# Altium project PCB_LED4PIN.PrjPcb
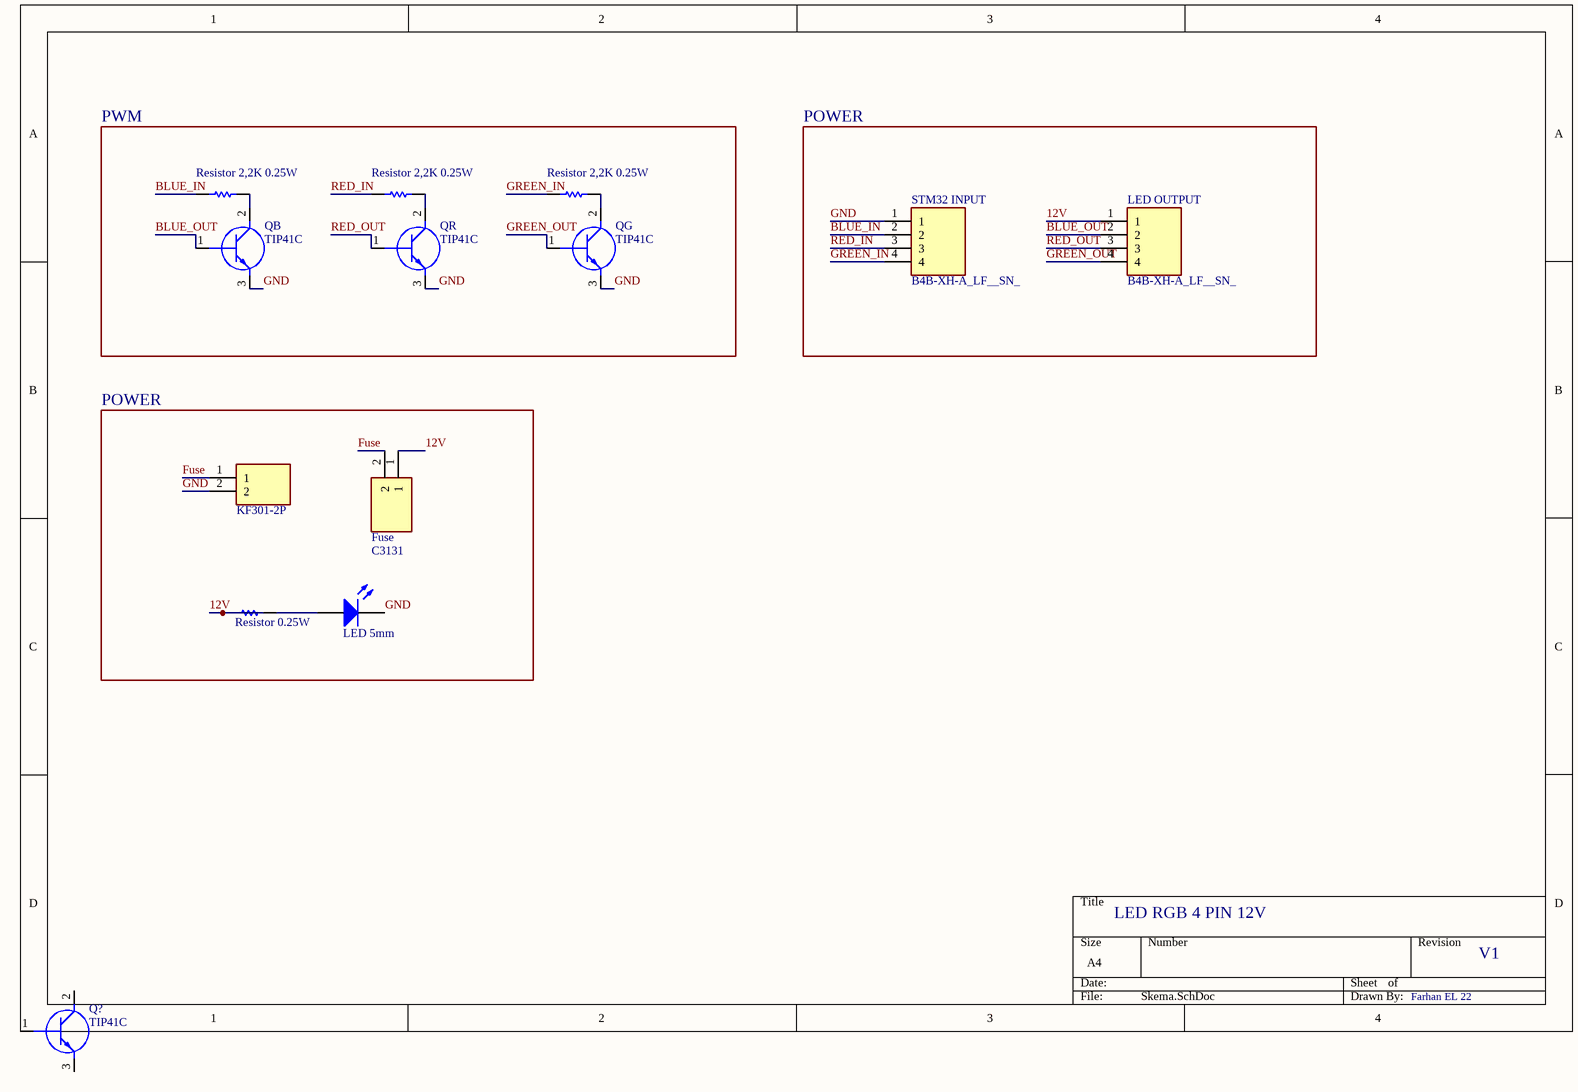
[diagram p0: Skema.SchDoc]
1 sheet, 13 parts. Net scope: global (net labels, ports and power ports of the same name join across sheets).
Board file: PCB_LED4Pin.PcbDoc

## Sheet Skema.SchDoc
size A4; SheetNumber: 1; SheetTotal: 1

### Parts
Fuse  C3131  [C3131]
LED  LED 5mm  [LED 5mm]
LED_OUTPUT  B4B-XH-A_LF__SN_  [B4BXHALFSN]
Power  KF301-2P  [KF3012P]
Q?  TIP41C  [TO254P482X1030X2322-3P]
QB  TIP41C  [TO254P482X1030X2322-3P]
QG  TIP41C  [TO254P482X1030X2322-3P]
QR  TIP41C  [TO254P482X1030X2322-3P]
R  Resistor 0.25W  [Resistor 0.25W]
RB_2.2K  Resistor 2,2K 0.25W  [Resistor 0.25W]
RG_2.2K  Resistor 2,2K 0.25W  [Resistor 0.25W]
RR_2.2K  Resistor 2,2K 0.25W  [Resistor 0.25W]
STM32_INPUT  B4B-XH-A_LF__SN_  [B4BXHALFSN]

### Blocks framed on the sheet
PWM: QB QG QR RB_2.2K RG_2.2K RR_2.2K
POWER: LED_OUTPUT STM32_INPUT
POWER: Fuse LED Power R

### Nets
12V: Fuse.1 LED_OUTPUT.1 R.1
BLUE_IN: RB_2.2K.1 STM32_INPUT.2
BLUE_OUT: LED_OUTPUT.2 QB.1(B)
Fuse: Fuse.2 Power.1
GND: LED.2(K) Power.2 QB.3(E) QG.3(E) QR.3(E) STM32_INPUT.1
GREEN_IN: RG_2.2K.1 STM32_INPUT.4
GREEN_OUT: LED_OUTPUT.4 QG.1(B)
RED_IN: RR_2.2K.1 STM32_INPUT.3
RED_OUT: LED_OUTPUT.3 QR.1(B)
NetLED_1: LED.1(A) R.2
NetQB_2: QB.2(C) RB_2.2K.2
NetQG_2: QG.2(C) RG_2.2K.2
NetQR_2: QR.2(C) RR_2.2K.2

Not connected (* = marked no-connect by the designer): Q? 1(B) 2(C) 3(E)

### Notes on the sheet
- LED RGB 4 PIN 12V
- V1
- Farhan EL 22

### Library data of the parts
Fuse = C3131: Undefined or Miscellaneous; Manufacturer_Name: Xucheng Elec; Datasheet Link: https://datasheet.lcsc.com/szlcsc/XC-Elec-Shenzhen-5x20-BLX-Fuse-holder_C3131.pdf; Height: 10.5mm; Manufacturer_Part_Number: C3131
LED_OUTPUT STM32_INPUT = B4B-XH-A_LF__SN_: Connector; Manufacturer_Name: JST (JAPAN SOLDERLESS TERMINALS); Manufacturer_Part_Number: B4B-XH-A(LF)(SN); Datasheet Link: https://datasheet.lcsc.com/szlcsc/JST-Sales-America-B4B-XH-A-LF-SN_C144395.pdf; Height: 7mm; Arrow Part Number: B4B-XH-A(LF)(SN); Arrow Price/Stock: https://www.arrow.com/en/products/b4b-xh-a-lf-sn/jst-manufacturing
Power = KF301-2P: Connector; Manufacturer_Name: Handson Technology; Datasheet Link: http://www.handsontec.com/dataspecs/terminal%20block-5mm.pdf; Height: 10mm; Manufacturer_Part_Number: KF301-2P
Q? QB QG QR = TIP41C: Transistor BJT NPN; Manufacturer_Name: Central Semiconductor; Datasheet Link: https://www.mouser.com/datasheet/2/68/tip41-1149816.pdf; Height: 4.82mm; Manufacturer_Part_Number: TIP41C; Mouser Part Number: 610-TIP41C; Mouser Price/Stock: https://www.mouser.com/Search/Refine.aspx?Keyword=610-TIP41C
RB_2.2K RG_2.2K RR_2.2K = Resistor 0.25W